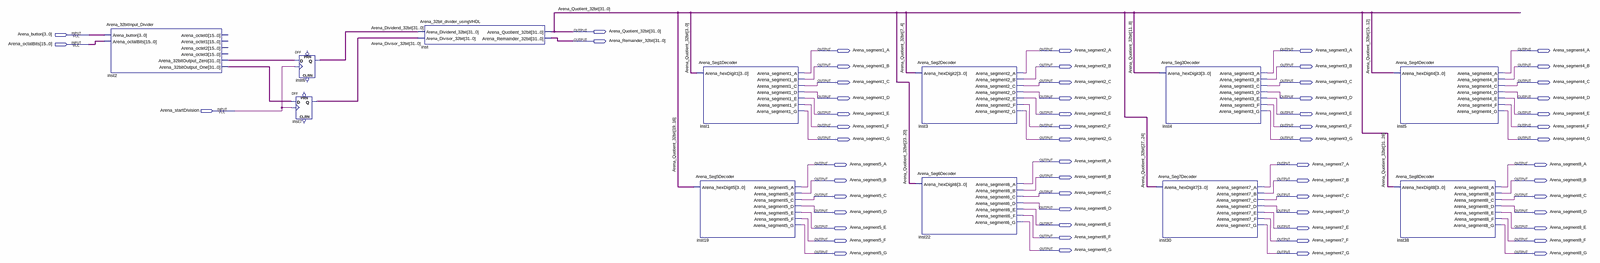
[diagram p0: schematic sheet, whole]
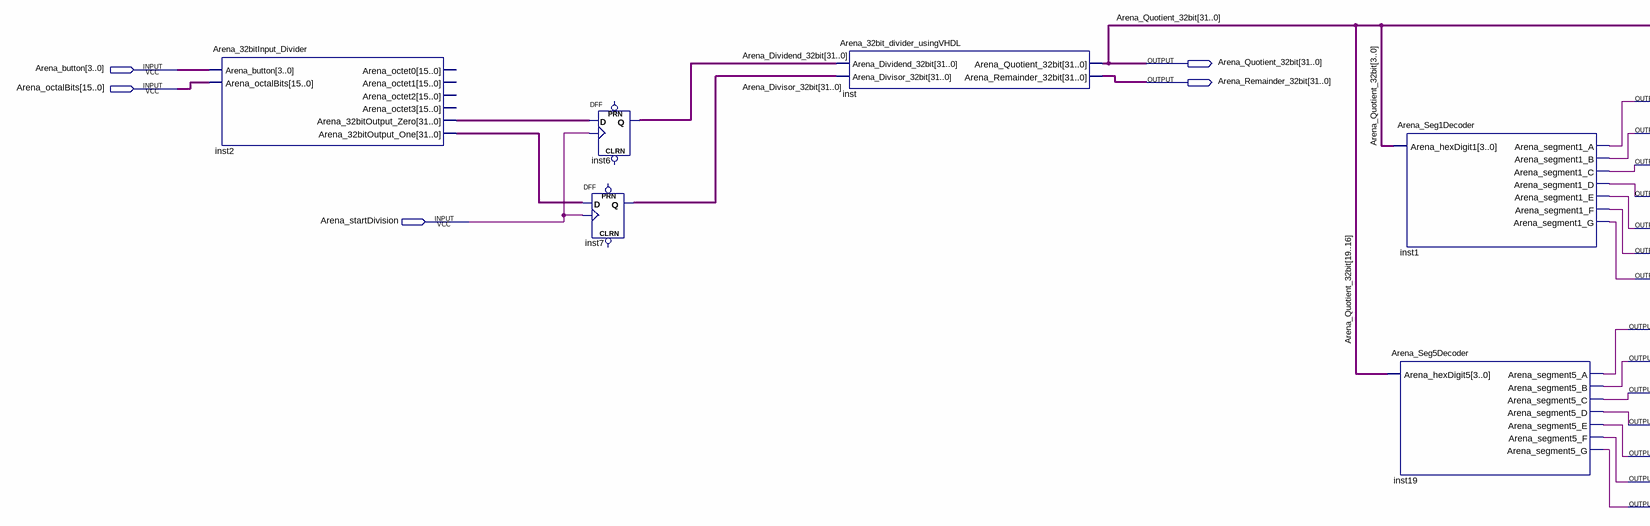
[diagram p1: schematic sheet, left part]
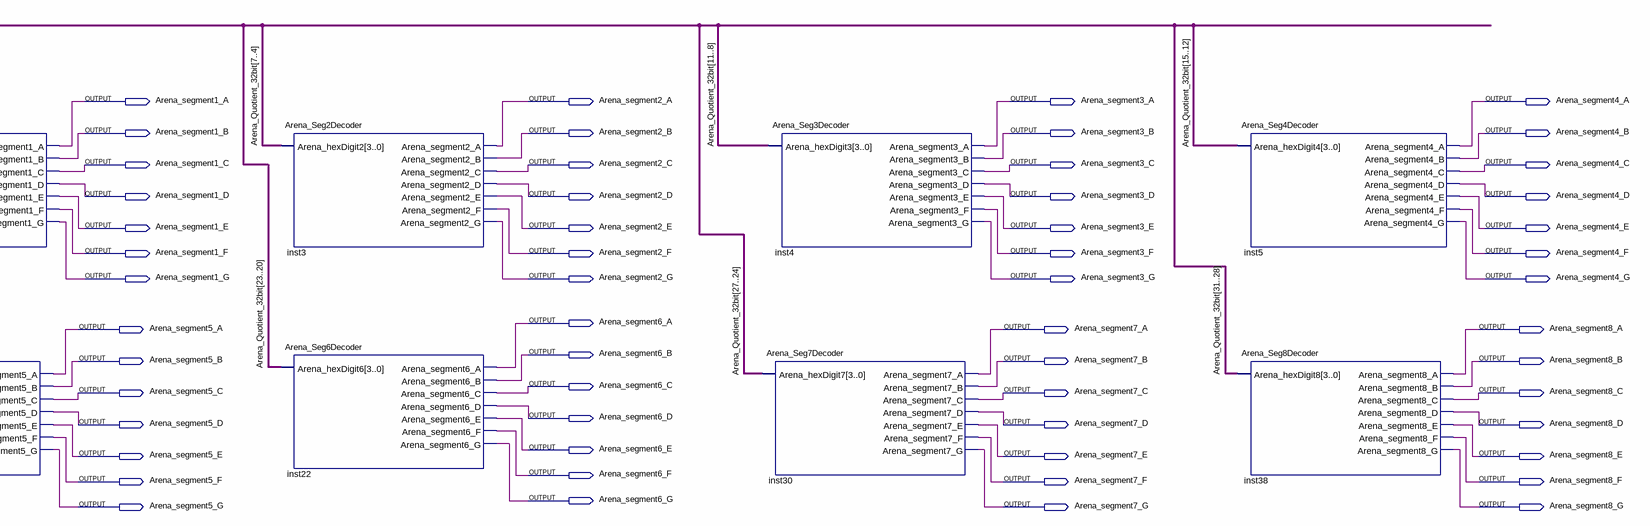
[diagram p2: schematic sheet, right part]
// Quartus schematic Arena_32bitDivider_withSegmentDisplay.bdf as structural Verilog: 12 symbols, 61 pins
module Arena_32bitDivider_withSegmentDisplay (
  input  [3:0] Arena_button,
  input  [15:0] Arena_octalBits,
  input  Arena_startDivision,
  output [31:0] Arena_Quotient_32bit,
  output [31:0] Arena_Remainder_32bit,
  output Arena_segment1_A,
  output Arena_segment2_A,
  output Arena_segment3_A,
  output Arena_segment4_A,
  output Arena_segment1_B,
  output Arena_segment2_B,
  output Arena_segment3_B,
  output Arena_segment4_B,
  output Arena_segment1_C,
  output Arena_segment2_C,
  output Arena_segment3_C,
  output Arena_segment4_C,
  output Arena_segment1_D,
  output Arena_segment2_D,
  output Arena_segment3_D,
  output Arena_segment4_D,
  output Arena_segment1_E,
  output Arena_segment2_E,
  output Arena_segment3_E,
  output Arena_segment4_E,
  output Arena_segment1_F,
  output Arena_segment2_F,
  output Arena_segment3_F,
  output Arena_segment4_F,
  output Arena_segment1_G,
  output Arena_segment2_G,
  output Arena_segment3_G,
  output Arena_segment4_G,
  output Arena_segment6_A,
  output Arena_segment5_A,
  output Arena_segment7_A,
  output Arena_segment8_A,
  output Arena_segment6_B,
  output Arena_segment5_B,
  output Arena_segment7_B,
  output Arena_segment8_B,
  output Arena_segment6_C,
  output Arena_segment5_C,
  output Arena_segment7_C,
  output Arena_segment8_C,
  output Arena_segment6_D,
  output Arena_segment5_D,
  output Arena_segment7_D,
  output Arena_segment8_D,
  output Arena_segment6_E,
  output Arena_segment5_E,
  output Arena_segment7_E,
  output Arena_segment8_E,
  output Arena_segment6_F,
  output Arena_segment5_F,
  output Arena_segment7_F,
  output Arena_segment8_F,
  output Arena_segment6_G,
  output Arena_segment5_G,
  output Arena_segment7_G,
  output Arena_segment8_G
);

  wire [31:0] Arena_Dividend_32bit, Arena_Divisor_32bit, inst2_arena_32bitoutput_one,
       inst2_arena_32bitoutput_zero;

  Arena_32bitInput_Divider inst2 (
    .Arena_button(Arena_button), .Arena_octalBits(Arena_octalBits),
    .Arena_32bitOutput_Zero(inst2_arena_32bitoutput_zero), .Arena_32bitOutput_One(inst2_arena_32bitoutput_one));  // open: Arena_octet0, Arena_octet1, Arena_octet2, Arena_octet3
  DFF inst6[31:0] (
    .CLK(Arena_startDivision), .D(inst2_arena_32bitoutput_zero), .Q(Arena_Dividend_32bit));  // open: CLRN, PRN
  DFF inst7[31:0] (
    .CLK(Arena_startDivision), .D(inst2_arena_32bitoutput_one), .Q(Arena_Divisor_32bit));  // open: CLRN, PRN
  Arena_32bit_divider_usingVHDL inst (
    .Arena_Dividend_32bit(Arena_Dividend_32bit), .Arena_Divisor_32bit(Arena_Divisor_32bit),
    .Arena_Quotient_32bit(Arena_Quotient_32bit), .Arena_Remainder_32bit(Arena_Remainder_32bit));
  Arena_Seg1Decoder inst1 (
    .Arena_hexDigit1(Arena_Quotient_32bit[3:0]), .Arena_segment1_A(Arena_segment1_A),
    .Arena_segment1_B(Arena_segment1_B), .Arena_segment1_C(Arena_segment1_C),
    .Arena_segment1_D(Arena_segment1_D), .Arena_segment1_E(Arena_segment1_E),
    .Arena_segment1_F(Arena_segment1_F), .Arena_segment1_G(Arena_segment1_G));
  Arena_Seg5Decoder inst19 (
    .Arena_hexDigit5(Arena_Quotient_32bit[19:16]), .Arena_segment5_A(Arena_segment5_A),
    .Arena_segment5_B(Arena_segment5_B), .Arena_segment5_C(Arena_segment5_C),
    .Arena_segment5_D(Arena_segment5_D), .Arena_segment5_E(Arena_segment5_E),
    .Arena_segment5_F(Arena_segment5_F), .Arena_segment5_G(Arena_segment5_G));
  Arena_Seg2Decoder inst3 (
    .Arena_hexDigit2(Arena_Quotient_32bit[7:4]), .Arena_segment2_A(Arena_segment2_A),
    .Arena_segment2_B(Arena_segment2_B), .Arena_segment2_C(Arena_segment2_C),
    .Arena_segment2_D(Arena_segment2_D), .Arena_segment2_E(Arena_segment2_E),
    .Arena_segment2_F(Arena_segment2_F), .Arena_segment2_G(Arena_segment2_G));
  Arena_Seg6Decoder inst22 (
    .Arena_hexDigit6(Arena_Quotient_32bit[23:20]), .Arena_segment6_A(Arena_segment6_A),
    .Arena_segment6_B(Arena_segment6_B), .Arena_segment6_C(Arena_segment6_C),
    .Arena_segment6_D(Arena_segment6_D), .Arena_segment6_E(Arena_segment6_E),
    .Arena_segment6_F(Arena_segment6_F), .Arena_segment6_G(Arena_segment6_G));
  Arena_Seg3Decoder inst4 (
    .Arena_hexDigit3(Arena_Quotient_32bit[11:8]), .Arena_segment3_A(Arena_segment3_A),
    .Arena_segment3_B(Arena_segment3_B), .Arena_segment3_C(Arena_segment3_C),
    .Arena_segment3_D(Arena_segment3_D), .Arena_segment3_E(Arena_segment3_E),
    .Arena_segment3_F(Arena_segment3_F), .Arena_segment3_G(Arena_segment3_G));
  Arena_Seg7Decoder inst30 (
    .Arena_hexDigit7(Arena_Quotient_32bit[27:24]), .Arena_segment7_A(Arena_segment7_A),
    .Arena_segment7_B(Arena_segment7_B), .Arena_segment7_C(Arena_segment7_C),
    .Arena_segment7_D(Arena_segment7_D), .Arena_segment7_E(Arena_segment7_E),
    .Arena_segment7_F(Arena_segment7_F), .Arena_segment7_G(Arena_segment7_G));
  Arena_Seg4Decoder inst5 (
    .Arena_hexDigit4(Arena_Quotient_32bit[15:12]), .Arena_segment4_A(Arena_segment4_A),
    .Arena_segment4_B(Arena_segment4_B), .Arena_segment4_C(Arena_segment4_C),
    .Arena_segment4_D(Arena_segment4_D), .Arena_segment4_E(Arena_segment4_E),
    .Arena_segment4_F(Arena_segment4_F), .Arena_segment4_G(Arena_segment4_G));
  Arena_Seg8Decoder inst38 (
    .Arena_hexDigit8(Arena_Quotient_32bit[31:28]), .Arena_segment8_A(Arena_segment8_A),
    .Arena_segment8_B(Arena_segment8_B), .Arena_segment8_C(Arena_segment8_C),
    .Arena_segment8_D(Arena_segment8_D), .Arena_segment8_E(Arena_segment8_E),
    .Arena_segment8_F(Arena_segment8_F), .Arena_segment8_G(Arena_segment8_G));
endmodule
